# Altium schematic sheet USB.SchDoc
size A3; DocumentNumber: 5; SheetNumber: 5; SheetTotal: 10; PageSetup: Record=PageOptions|CenterHorizontal=True|CenterVertical=True|PrintScale=0.97|XCorrection=1.00|YCorrection=1.00|PrintKind=1|BorderSize=5000000|LeftOffset=0|BottomOffset=0|Orientation=2|PaperLength=2970|PaperWidth=2100|Scale=100|PaperSource=7|PrintQuality=600|MediaType=1|DitherType=10|PaperKind=A4|PrintScaleMode=1
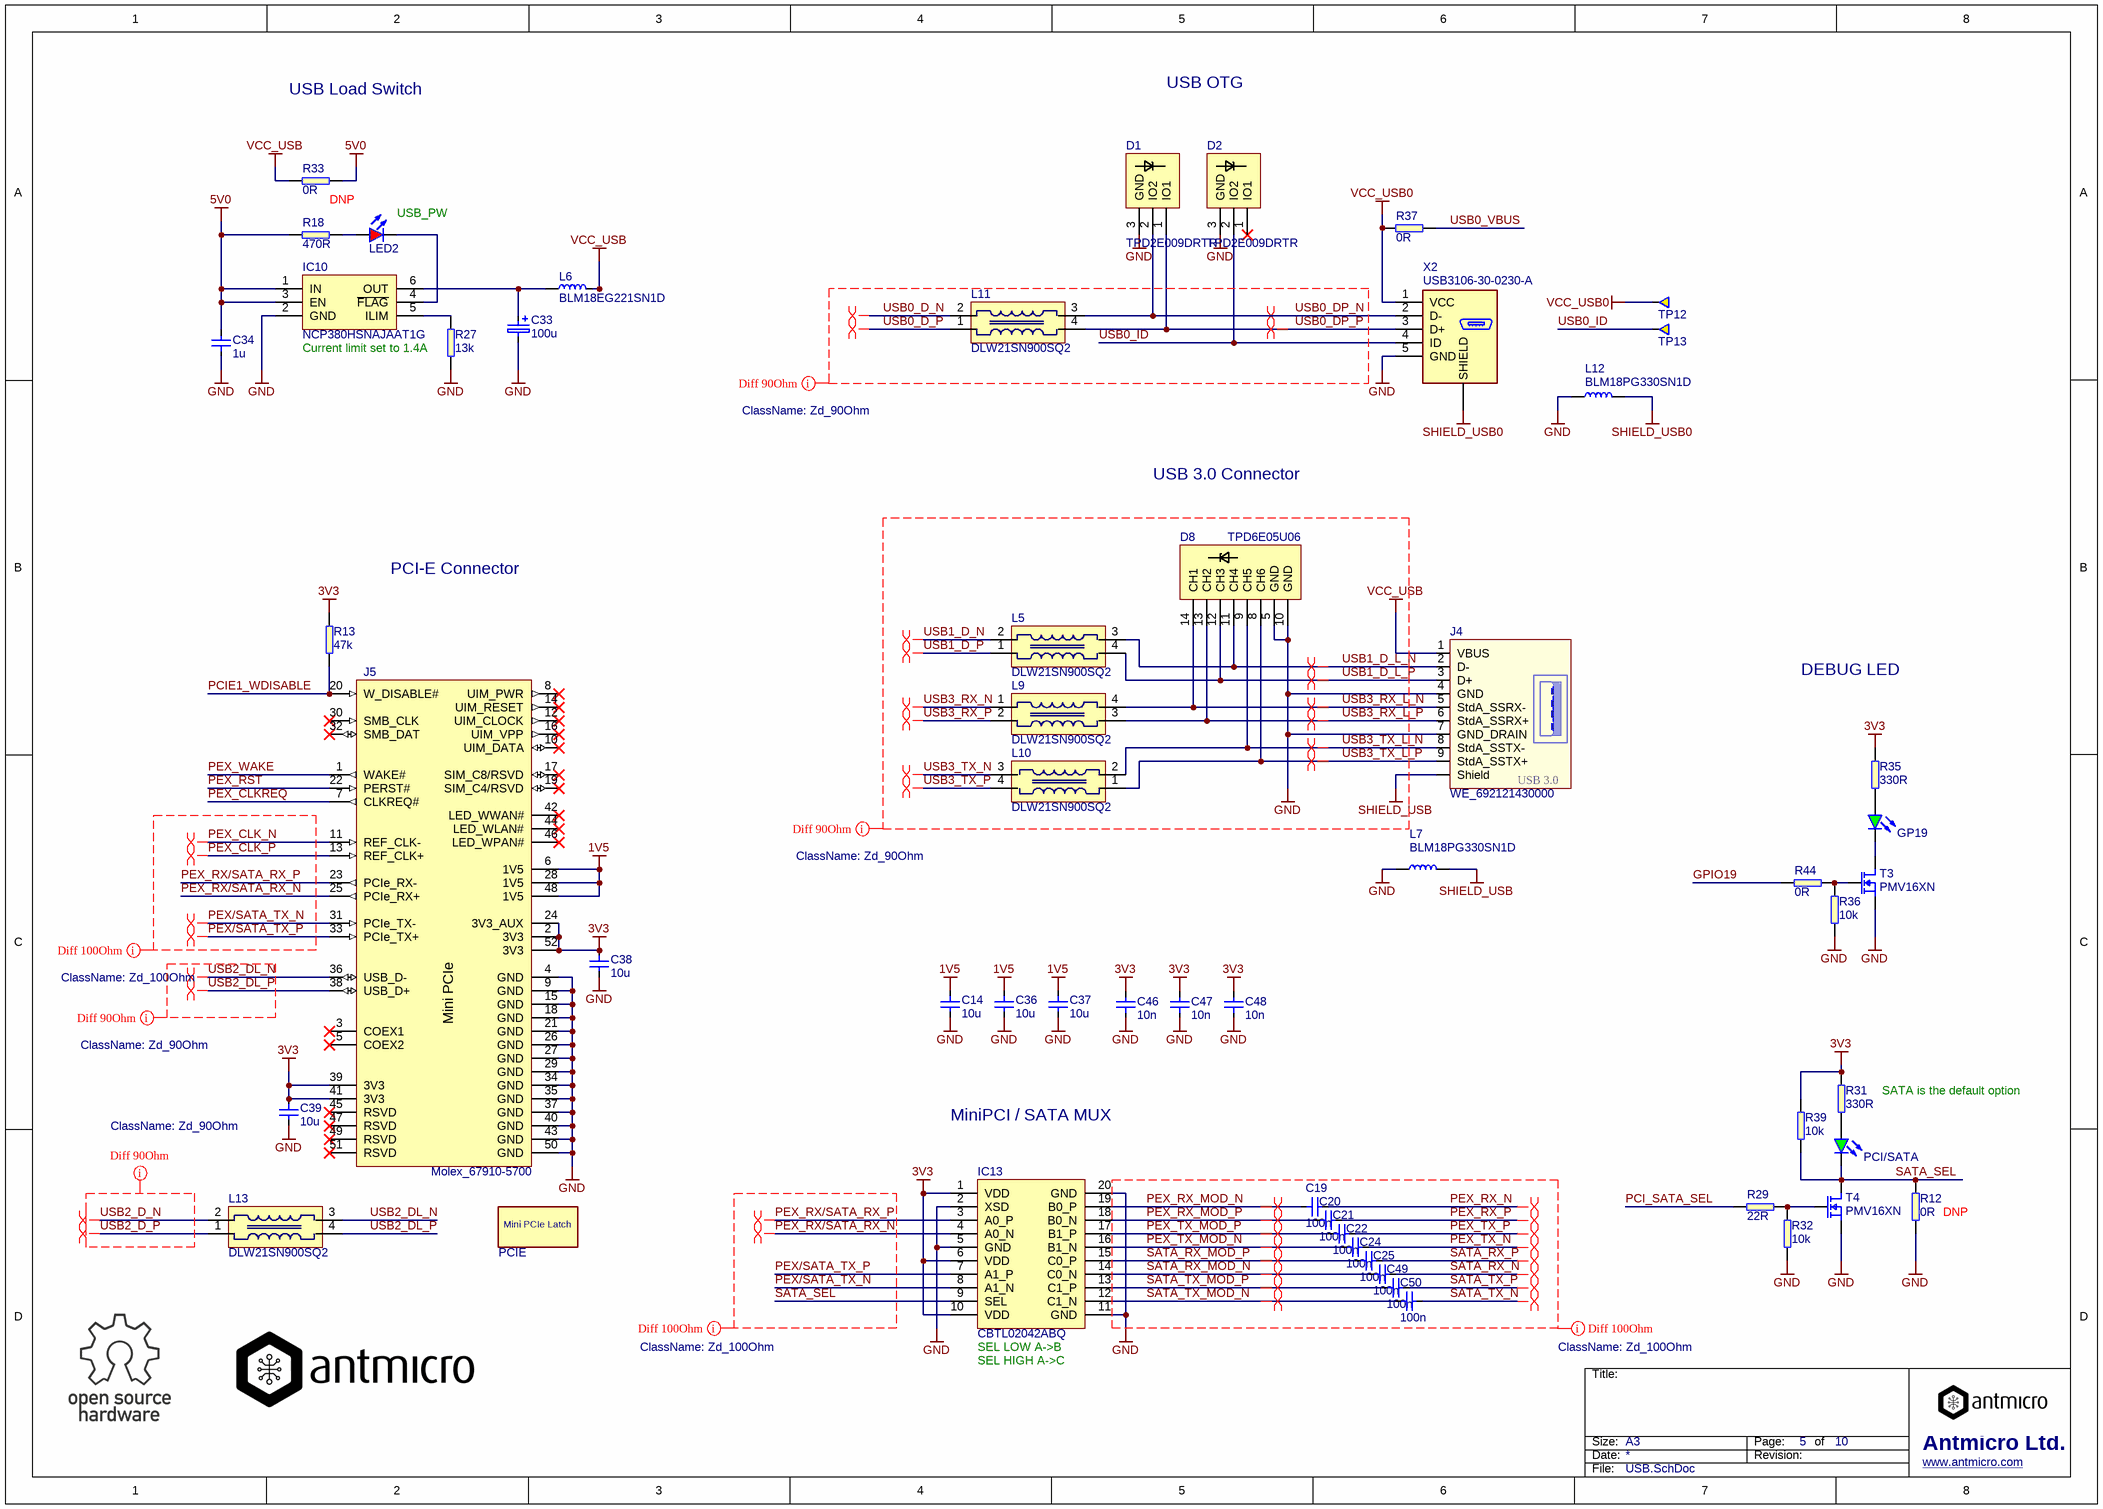
[diagram p0: USB.SchDoc]

## Parts
C14  10u  [0603]
C19  100n  [0402]
C20  100n  [0402]
C21  100n  [0402]
C22  100n  [0402]
C24  100n  [0402]
C25  100n  [0402]
C33  100u  [KEMET_A]
C34  1u  [0603]
C36  10u  [0603]
C37  10u  [0603]
C38  10u  [0603]
C39  10u  [0603]
C46  10n  [0603]
C47  10n  [0603]
C48  10n  [0603]
C49  100n  [0402]
C50  100n  [0402]
D1  TPD2E009DRTR  [SOT-3]
D2  TPD2E009DRTR  [SOT-3]
D8  TPD6E05U06  [TPD6E05U06_PASS]
GP19  KPT-1608SGC  [LED0603]  (value not drawn)
IC10  NCP380HSNAJAAT1G  [TSOP-6]
IC13  CBTL02042ABQ  [DHVQFN20]
J4  WE_692121430000  [WE_692121430000]
J5  Molex_67910-5700  [T_Molex_67910-5700]
L5  DLW21SN900SQ2  [DLW21SN900SQ2]
L6  BLM18EG221SN1D  [0603]
L7  BLM18PG330SN1D  [0603]
L9  DLW21SN900SQ2  [DLW21SN900SQ2]
L10  DLW21SN900SQ2  [DLW21SN900SQ2]
L11  DLW21SN900SQ2  [DLW21SN900SQ2]
L12  BLM18PG330SN1D  [0603]
L13  DLW21SN900SQ2  [DLW21SN900SQ2]
LED2  KPT-1608EC  [LED0603]  (value not drawn)
PCI/SATA  KPT-1608SGC  [LED0603]  (value not drawn)
PCIE  MECH-Molex-48099-5701  [MECH-Molex-48099-5701]  (value not drawn)  (mechanical)
R12  0R  [0603]
R13  47k  [0603]
R18  470R  [0603]
R27  13k  [0603]
R29  22R  [0603]
R31  330R  [0603]
R32  10k  [0603]
R33  0R  [0603]
R35  330R  [0603]
R36  10k  [0603]
R37  0R  [0603]
R39  10k  [0603]
R44  0R  [0603]
T3  PMV16XN  [SOT-23]
T4  PMV16XN  [SOT-23]
TP12  (no value)  [TP-R-2]  (no BOM)
TP13  (no value)  [TP-R-2]  (no BOM)
X2  USB3106-30-0230-A  [USB3106]

## Nets
1V5: C14.1 C36.1 C37.1 J5.6(1V5) J5.28(1V5) J5.48(1V5)
3V3: C38.1 C39.1 C46.2 C47.2 C48.2 IC13.1(VDD) IC13.6(VDD) IC13.10(VDD) J5.2(3V3) J5.24(3V3_AUX) J5.39(3V3) J5.41(3V3) J5.52(3V3) R13.2 R31.2 R35.2 R39.2
5V0: C34.2 IC10.1(IN) IC10.3(EN) R18.2 R33.2
GND: C14.2 C33.2 C34.1 C36.2 C37.2 C38.2 C39.2 C46.1 C47.1 C48.1 D1.3(GND) D2.3(GND) D8.5(GND) D8.10(GND) IC10.2(GND) IC13.2(XSD) IC13.5(GND) IC13.11(GND) IC13.20(GND) J4.4(GND) J4.7(GND_DRAIN) J5.4(GND) J5.9(GND) J5.15(GND) J5.18(GND) J5.21(GND) J5.26(GND) J5.27(GND) J5.29(GND) J5.34(GND) J5.35(GND) J5.37(GND) J5.40(GND) J5.43(GND) J5.50(GND) L7.1 L12.1 R12.1 R27.1 R32.1 R36.1 T3.2(S) T4.2(S) X2.5(GND)
SHIELD_USB: J4.Z1(Shield) L7.2
SHIELD_USB0: L12.2 X2.S(SHIELD)
VCC_USB: J4.1(VBUS) L6.2 R33.1
VCC_USB0: R37.1 TP12.1 X2.1(VCC)
GPIO19: R44.1
PCI_SATA_SEL: R29.1
PCIE1_WDISABLE: J5.20(W_DISABLE#) R13.1
PEX/SATA_TX_N: IC13.8(A1_N) J5.31(PCIe_TX-)
PEX/SATA_TX_P: IC13.7(A1_P) J5.33(PCIe_TX+)
PEX_CLK_N: J5.11(REF_CLK-)
PEX_CLK_P: J5.13(REF_CLK+)
PEX_CLKREQ: J5.7(CLKREQ#)
PEX_RST: J5.22(PERST#)
PEX_RX/SATA_RX_N: IC13.4(A0_N) J5.25(PCIe_RX+)
PEX_RX/SATA_RX_P: IC13.3(A0_P) J5.23(PCIe_RX-)
PEX_RX_MOD_N: C19.1 IC13.19(B0_P)
PEX_RX_MOD_P: C20.1 IC13.18(B0_N)
PEX_RX_N: C19.2
PEX_RX_P: C20.2
PEX_TX_MOD_N: C22.1 IC13.16(B1_N)
PEX_TX_MOD_P: C21.1 IC13.17(B1_P)
PEX_TX_N: C22.2
PEX_TX_P: C21.2
PEX_WAKE: J5.1(WAKE#)
SATA_RX_MOD_N: C25.1 IC13.14(C0_N)
SATA_RX_MOD_P: C24.1 IC13.15(C0_P)
SATA_RX_N: C25.2
SATA_RX_P: C24.2
SATA_SEL: IC13.9(SEL) PCI/SATA.K R12.2 R39.1 T4.3(D)
SATA_TX_MOD_N: C50.1 IC13.12(C1_N)
SATA_TX_MOD_P: C49.1 IC13.13(C1_P)
SATA_TX_N: C50.2
SATA_TX_P: C49.2
USB0_D_N: L11.2
USB0_D_P: L11.1
USB0_DP_N: D1.2(IO2) L11.3 X2.2(D-)
USB0_DP_P: D1.1(IO1) L11.4 X2.3(D+)
USB0_ID: D2.2(IO2) TP13.1 X2.4(ID)
USB0_VBUS: R37.2
USB1_D_L_N: D8.11(CH4) J4.2(D-) L5.3
USB1_D_L_P: D8.12(CH3) J4.3(D+) L5.4
USB1_D_N: L5.2
USB1_D_P: L5.1
USB2_D_N: L13.2
USB2_D_P: L13.1
USB2_DL_N: J5.36(USB_D-) L13.3
USB2_DL_P: J5.38(USB_D+) L13.4
USB3_RX_L_N: D8.14(CH1) J4.5(StdA_SSRX-) L9.4
USB3_RX_L_P: D8.13(CH2) J4.6(StdA_SSRX+) L9.3
USB3_RX_N: L9.1
USB3_RX_P: L9.2
USB3_TX_L_N: D8.9(CH5) J4.8(StdA_SSTX-) L10.2
USB3_TX_L_P: D8.8(CH6) J4.9(StdA_SSTX+) L10.1
USB3_TX_N: L10.3
USB3_TX_P: L10.4
NetC33_1: C33.1 IC10.6(OUT) L6.1
NetGP19_A: GP19.A R35.1
NetGP19_K: GP19.K T3.3(D)
NetIC10_4: IC10.4(~{FLAG}) LED2.K
NetIC10_5: IC10.5(ILIM) R27.2
NetLED2_A: LED2.A R18.1
NetPCI/SATA_A: PCI/SATA.A R31.1
NetR29_2: R29.2 R32.2 T4.1(G)
NetR36_2: R36.2 R44.2 T3.1(G)

Not connected (* = marked no-connect by the designer): D2 1(IO1)*; J5 3(COEX1)* 5(COEX2)* 8(UIM_PWR)* 10(UIM_DATA)* 12(UIM_CLOCK)* 14(UIM_RESET)* 16(UIM_VPP)* 17(SIM_C8/RSVD)* 19(SIM_C4/RSVD)* 30(SMB_CLK)* 32(SMB_DAT)* 42(LED_WWAN#)* 44(LED_WLAN#)* 45(RSVD)* 46(LED_WPAN#)* 47(RSVD)* 49(RSVD)* 51(RSVD)*

## Layout directives
differential pair: PEX/SATA_TX_N, PEX/SATA_TX_P, PEX_CLK_N, PEX_CLK_P, PEX_RX/SATA_RX_N, PEX_RX/SATA_RX_P, PEX_RX_MOD_N, PEX_RX_MOD_P, PEX_RX_N, PEX_RX_P, PEX_TX_MOD_N, PEX_TX_MOD_P, PEX_TX_N, PEX_TX_P, SATA_RX_MOD_N, SATA_RX_MOD_P, SATA_RX_N, SATA_RX_P, SATA_TX_MOD_N, SATA_TX_MOD_P, SATA_TX_N, SATA_TX_P, USB0_D_N, USB0_D_P, USB0_DP_N, USB0_DP_P, USB1_D_L_N, USB1_D_L_P, USB1_D_N, USB1_D_P, USB2_D_N, USB2_D_P, USB2_DL_N, USB2_DL_P, USB3_RX_L_N, USB3_RX_L_P, USB3_RX_N, USB3_RX_P, USB3_TX_L_N, USB3_TX_L_P, USB3_TX_N, USB3_TX_P
net class Zd_100Ohm: GND, PEX/SATA_TX_N, PEX/SATA_TX_P, PEX_CLK_N, PEX_CLK_P, PEX_RX/SATA_RX_N, PEX_RX/SATA_RX_P, PEX_RX_MOD_N, PEX_RX_MOD_P, PEX_RX_N, PEX_RX_P, PEX_TX_MOD_N, PEX_TX_MOD_P, PEX_TX_N, PEX_TX_P, SATA_RX_MOD_N, SATA_RX_MOD_P, SATA_RX_N, SATA_RX_P, SATA_SEL, SATA_TX_MOD_N, SATA_TX_MOD_P, SATA_TX_N, SATA_TX_P
net class Zd_90Ohm: GND, SHIELD_USB, USB0_D_N, USB0_D_P, USB0_DP_N, USB0_DP_P, USB0_ID, USB1_D_L_N, USB1_D_L_P, USB1_D_N, USB1_D_P, USB2_D_N, USB2_D_P, USB2_DL_N, USB2_DL_P, USB3_RX_L_N, USB3_RX_L_P, USB3_RX_N, USB3_RX_P, USB3_TX_L_N, USB3_TX_L_P, USB3_TX_N, USB3_TX_P, VCC_USB

## Notes on the sheet
- USB Load Switch
- USB OTG
- (near R33) DNP
- (near LED2) USB_PW
- (near R27) Current limit set to 1.4A
- USB 3.0 Connector
- PCI-E Connector
- DEBUG LED
- MiniPCI / SATA MUX
- SATA is the default option
- (near R12) DNP
- (near IC13) SEL LOW A->B
- (near IC13) SEL HIGH A->C
- Title:
- Size:
- Date:
- A3
- Revision:
- Page:
- of
- Antmicro Ltd.
- File:
- www.antmicro.com
- (in symbol CON-Molex-67910-5700) Mini PCIe
- (in symbol MECH-Molex-48099-5701) Mini PCIe Latch
- (in symbol WE_692121430000) USB 3.0

## Library data of the parts
C14 C36-C39 = C_10u_0603: MLCC SMT Capacitor 10uF 0603; Manufacturer: MULTICOMP; Part Symbol: MC0603X106M6R3CT; Value: 10u; Part Number: C_10u_0603
C19-C22 C24 C25 C49 C50 = C_100n_0402: MLCC SMT Capacitor 100nF 0402; Manufacturer: MULTICOMP; Part Symbol: MC0402X104M100CT; Value: 100n; Part Number: C_100n_0402
C33 = C_100u_KEMET_A: Tantalum SMT Capacitor 100uF Case KEMET_A; Manufacturer: VISHAY; Part Symbol: 298D107X06R3A2T; Value: 100u; Part Number: C_100u_KEMET_A
C34 = C_1u_0603: MLCC SMT Capacitor 1uF 0603; Manufacturer: MULTICOMP; Part Symbol: MC0603X105M6R3CT; Value: 1u; Part Number: C_1u_0603
C46-C48 = C_10n_0603: MLCC SMT Capacitor 10nF 0603; Manufacturer: AVX; Part Symbol: 06031C103JAT2A; Value: 10n; Part Number: C_10n_0603
D1 D2 = TPD2E009: ESD Suppressors 2-CH; Manufacturer: Texas Instruments; Part Number: TPD2E009DRTR; Value: TPD2E009DRTR; Part Symbol: TPD2E009DRTR
D8 = TPD6E05U06_PASS: ESD Suppressors 6-CH Pass through layout; Manufacturer: Texas Instruments; Part Symbol: TPD6E05U06RVZR; Part Number: TPD6E05U06_PASS; Value: TPD6E05U06
GP19 = LED_G: LED Green 0603 case; Manufacturer: KINGBRIGHT; Part Number: LED_G; Value: KPT-1608SGC; Part Symbol: KPT-1608SGC
IC10 = NCP380HSNAJAAT1G: POWER LOAD SWITCH, HIGH SIDE; Manufacturer: ON Semiconductor; Part Number: NCP380HSNAJAAT1G; Value: NCP380HSNAJAAT1G; Part Symbol: NCP380HSNAJAAT1G
IC13 = CBTL02042A: IC MUX/DEMUX 2:1 PCI 20DHVQFN; Manufacturer: NXP Semiconductors; Part Symbol: CBTL02042ABQ,115; Part Number: CBTL02042ABQ; Value: CBTL02042ABQ
J4 = WE_692121430000: WURTH ELEKTRONIK 	692121430000  USB Connector, USB Type A, USB 3.0, Receptacle, 9 Ways, PCB Mount, Vertical; Part Number: WE_692121430000; Value: WE_692121430000; Manufacturer: WURTH ELEKTRONIK; Part Symbol: 692121430000
J5 = CON-Molex-67910-5700: PCIe Mini Card Holder 4mm; Manufacturer: Molex; Part Number: CON-Molex-67910-5700; Value: Molex_67910-5700; Part Symbol: 67910-5700
L5 L9-L11 L13 = DLW21SN900SQ2: Common mode choke; Manufacturer: MURATA; Part Symbol: DLW21SN900SQ2L; Part Number: DLW21SN900SQ2; Value: DLW21SN900SQ2
L6 = BLM18EG221SN1D: MURATA 	BLM18EG221SN1D  FERRITE BEAD, 0.05OHM, 2A, 0603; Part Number: BLM18EG221SN1D; Value: BLM18EG221SN1D; Manufacturer: MURATA; Part Symbol: BLM18EG221SN1D
L7 L12 = BLM18PG330SN1D: MURATA 	BLM18PG330SN1D  FERRITE BEAD, 0.025OHM, 3A, 0603; Part Number: BLM18PG330SN1D; Value: BLM18PG330SN1D; Manufacturer: MURATA; Part Symbol: BLM18PG330SN1D
LED2 = LED_R: LED Red 0603 case; Part Number: LED_R; Manufacturer: KINGBRIGHT; Value: KPT-1608EC; Part Symbol: KPT-1608EC
PCI/SATA = LED_G: LED Green 0603 case; Part Number: LED_G; Manufacturer: KINGBRIGHT; Value: KPT-1608SGC; Part Symbol: KPT-1608SGC
PCIE = MECH-Molex-48099-5701: PCI Express/PCI Connectors LATCH ASSY FOR MINIP CI-ENEW TYPE W/COVER; Manufacturer: Molex; Part Number: MECH-Molex-48099-5701; Value: MECH-Molex-48099-5701; Part Symbol: 48099-5701
R12 R33 R37 R44 = R_0R_0603: SMT Resistor 0R 0603; Manufacturer: BOURNS; Part Symbol: CR0603-J/-000ELF; Part Number: R_0R_0603; Value: 0R
R13 = R_47k_0603: SMT Resistor 47k 0603; Manufacturer: MULTICOMP; Part Symbol: MCWR06X4702FTL; Value: 47k; Part Number: R_47k_0603
R18 = R_470R_0603: SMT Resistor 470R 0603; Manufacturer: BOURNS; Part Symbol: CR0603-JW-471GLF; Value: 470R; Part Number: R_470R_0603
R27 = R_13k_0603: SMT Resistor 13k 0603; Manufacturer: PANASONIC ELECTRONIC COMPONENTS; Part Symbol: ERJ3GEYJ133V; Value: 13k; Part Number: R_13k_0603
R29 = R_22R_0603: SMT Resistor 22R 0603; Manufacturer: BOURNS; Part Symbol: CR0603-JW-220GLF; Value: 22R; Part Number: R_22R_0603
R31 R35 = R_330R_0603: SMT Resistor 330R 0603; Manufacturer: BOURNS; Part Symbol: CR0603-FX-3300GLF; Part Number: R_330R_0603; Value: 330R
R32 R36 R39 = R_10k_0603: SMT Resistor 10k 0603; Manufacturer: BOURNS; Part Symbol: CR0603-JW-103ELF; Value: 10k; Part Number: R_10k_0603
T3 T4 = PMV16XN: MOSFET Transistor, N Channel, 6.8 A, 20 V, 0.016 ohm, 4.5 V; Manufacturer: NXP; Value: PMV16XN; Part Number: PMV16XN; Part Symbol: PMV16XN
TP12 TP13 = TP-R-2: Testpad, round, 2mm; Part Number: TP-R-2
X2 = Micro USB A/B TH Vert: Micro USB A/B TH Vertical; Manufacturer: GLOBAL CONNECTOR TECHNOLOGY; Part Symbol: USB3105-30-A; Part Number: Micro USB A/B TH Vert; Value: USB3106-30-0230-A